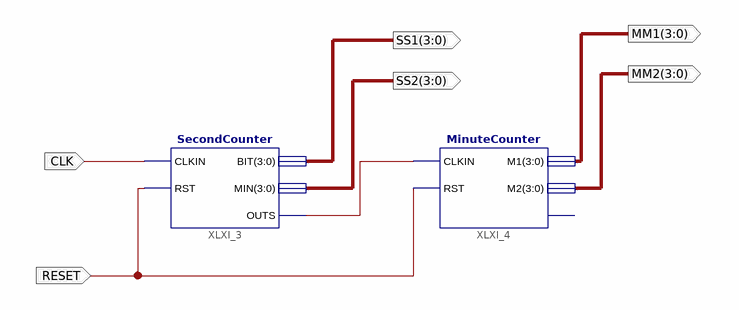
[diagram p0: schematic sheet 1]
// Xilinx ISE schematic Clock_MMSS.sch (spartan6) as structural Verilog: 2 symbols, 6 ports
module Clock_MMSS (
  input  RESET,
  input  CLK,
  output [3:0] SS1,
  output [3:0] SS2,
  output [3:0] MM1,
  output [3:0] MM2
);

  wire XLXN_1;

  SecondCounter XLXI_3 (.BIT(SS1), .CLKIN(CLK), .MIN(SS2), .OUTS(XLXN_1), .RST(RESET));
  MinuteCounter XLXI_4 (.CLKIN(XLXN_1), .M1(MM1), .M2(MM2), .RST(RESET));  // open: OUTM
endmodule
